# Altium schematic sheet Peripheral.SchDoc
size 420 x 297 mm; CheckedBy: Bao Bui Q.; Engineer: Hung Nguyen D.; Revision: 1.0.0; SheetNumber: 5; SheetTotal: 6
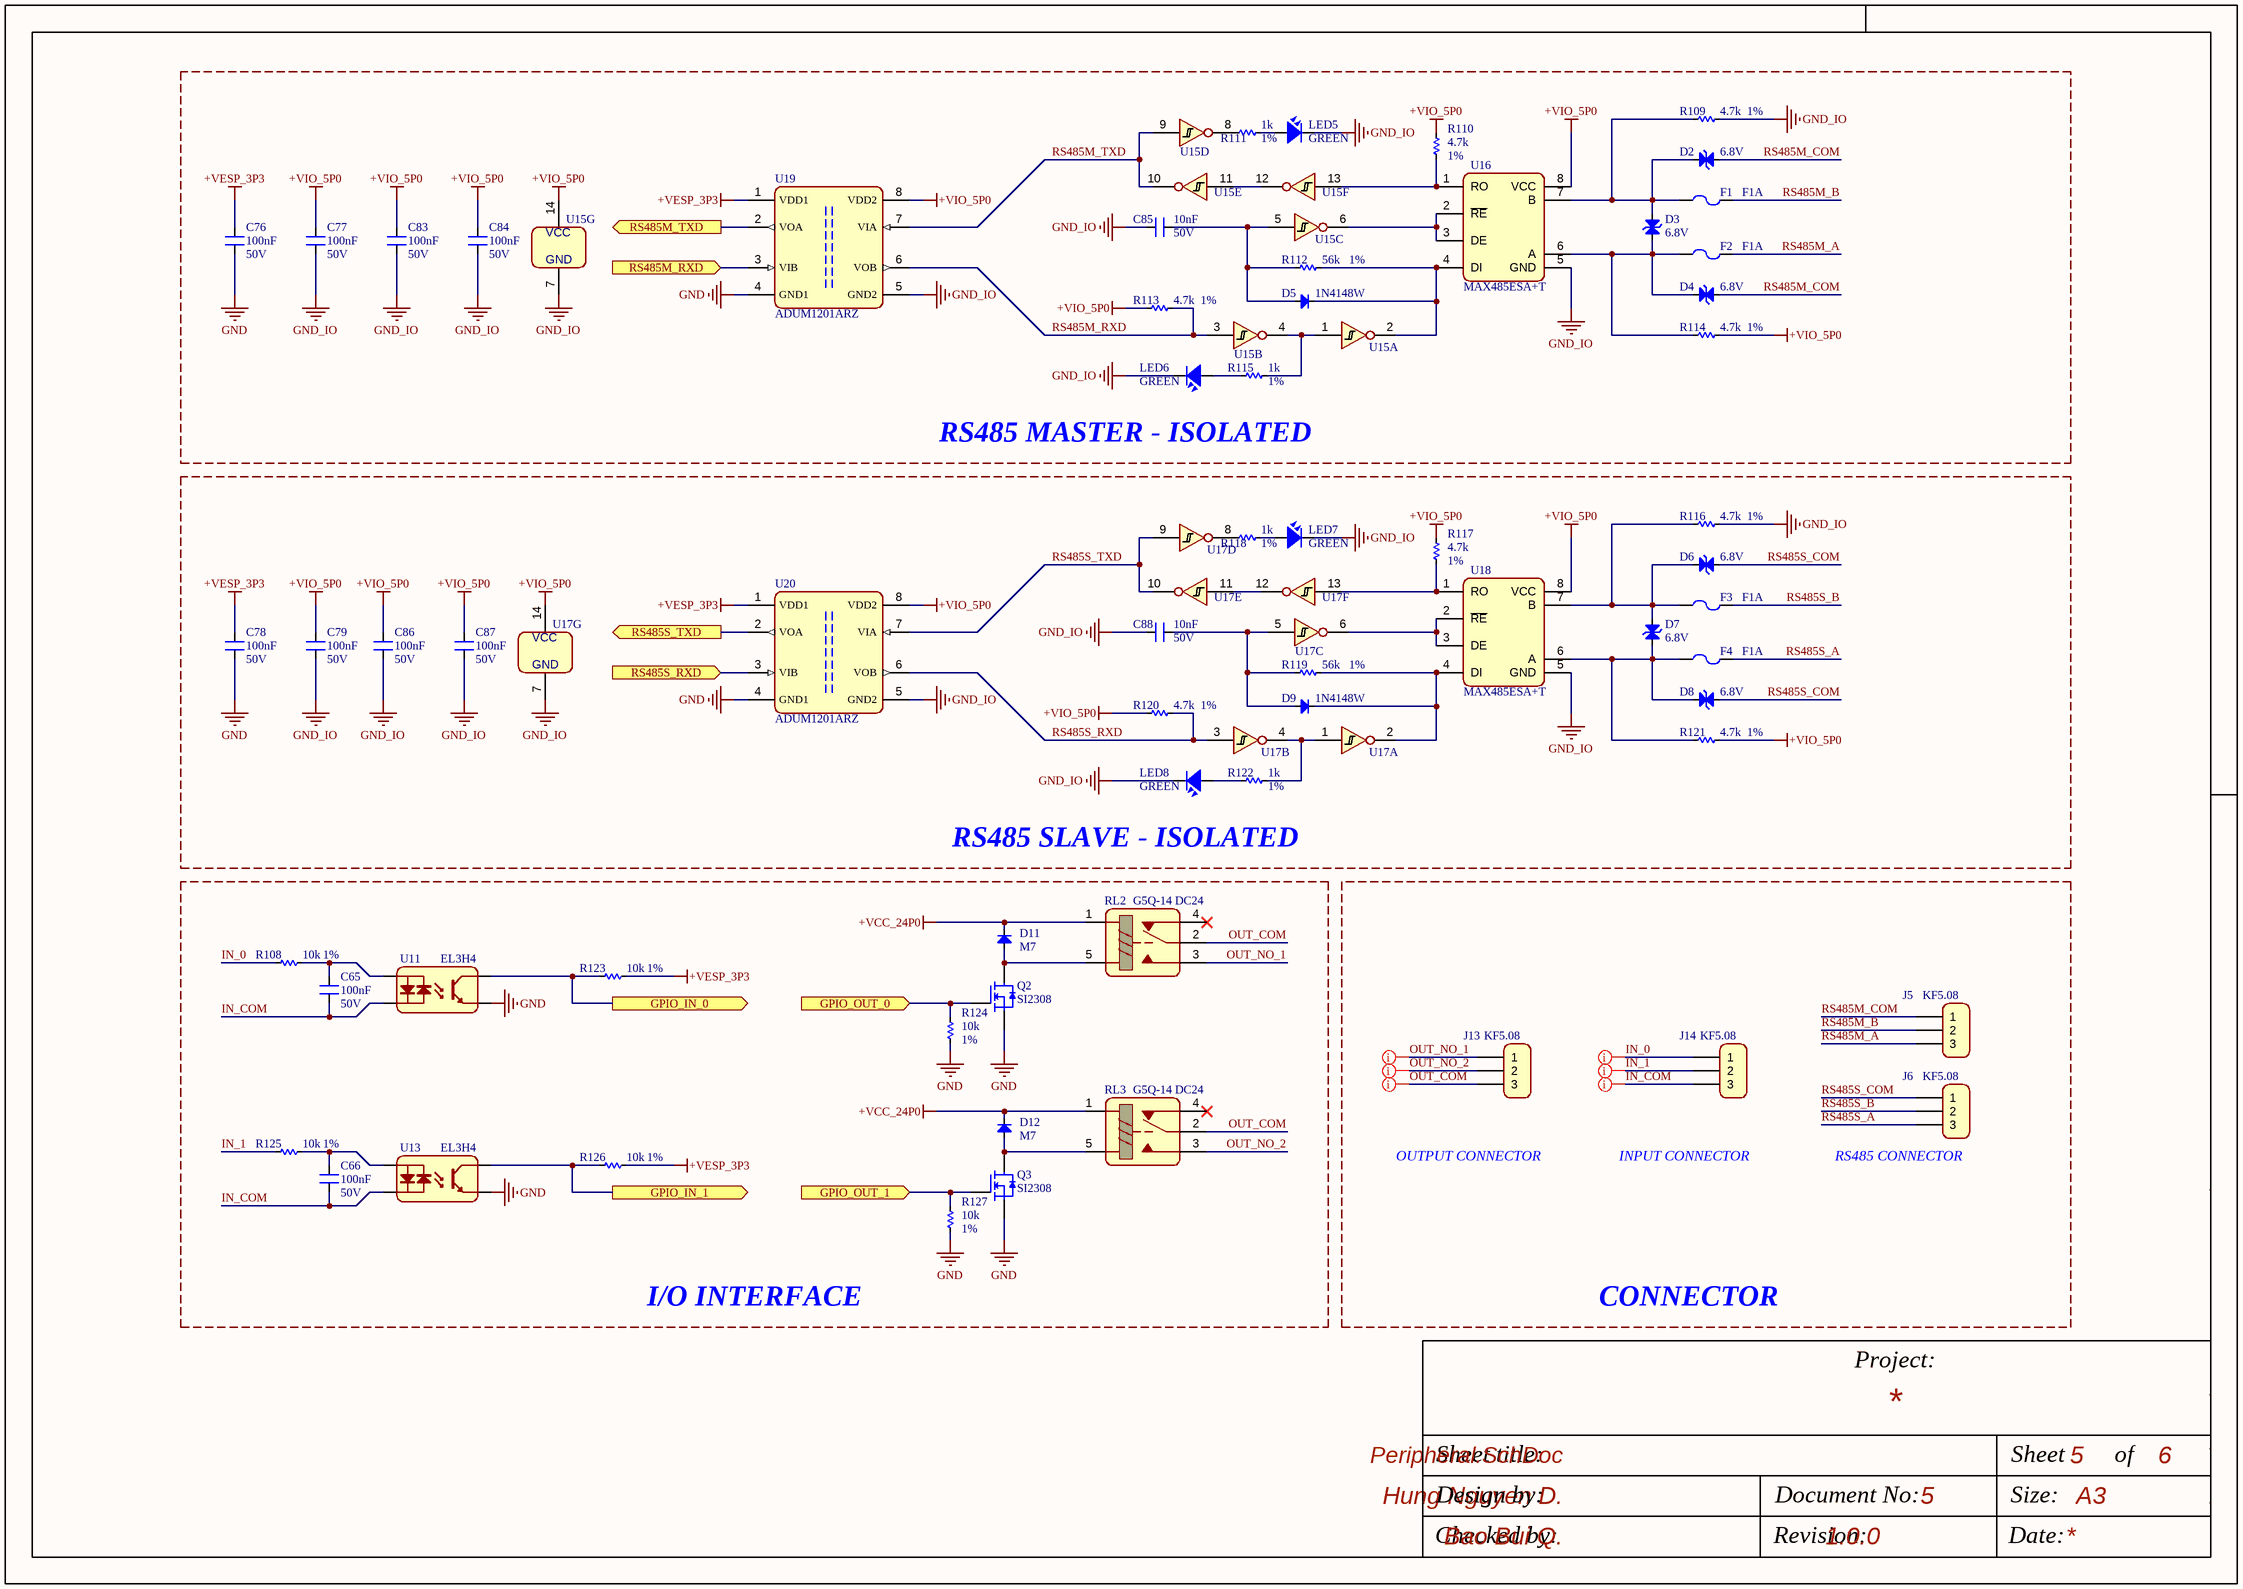
[diagram p0: Peripheral.SchDoc]

## Parts
C65  Rating: 50V  [CAP_SMD_0603]  (hidden comment: 100nF)
C66  Rating: 50V  [CAP_SMD_0603]  (hidden comment: 100nF)
C76  Rating: 50V  [CAP_SMD_0603]  (hidden comment: 100nF)
C77  Rating: 50V  [CAP_SMD_0603]  (hidden comment: 100nF)
C78  Rating: 50V  [CAP_SMD_0603]  (hidden comment: 100nF)
C79  Rating: 50V  [CAP_SMD_0603]  (hidden comment: 100nF)
C83  Rating: 50V  [CAP_SMD_0603]  (hidden comment: 100nF)
C84  Rating: 50V  [CAP_SMD_0603]  (hidden comment: 100nF)
C85  Rating: 50V  [CAP_SMD_0603]  (hidden comment: 10nF)
C86  Rating: 50V  [CAP_SMD_0603]  (hidden comment: 100nF)
C87  Rating: 50V  [CAP_SMD_0603]  (hidden comment: 100nF)
C88  Rating: 50V  [CAP_SMD_0603]  (hidden comment: 10nF)
D2  6.8V  [SOD123FL]
D3  6.8V  [SOD123FL]
D4  6.8V  [SOD123FL]
D5  1N4148W  [SOD323]
D6  6.8V  [SOD123FL]
D7  6.8V  [SOD123FL]
D8  6.8V  [SOD123FL]
D9  1N4148W  [SOD323]
D11  M7  [DIO-SMD-A]
D12  M7  [DIO-SMD-A]
F1  F1A  [FUSE_1812]
F2  F1A  [FUSE_1812]
F3  F1A  [FUSE_1812]
F4  F1A  [FUSE_1812]
J5  KF5.08  [KF3-5.08X]
J6  KF5.08  [KF3-5.08X]
J13  KF5.08  [KF3-5.08X]
J14  KF5.08  [KF3-5.08X]
LED5  GREEN  [GREENLED_0603]
LED6  GREEN  [GREENLED_0603]
LED7  GREEN  [GREENLED_0603]
LED8  GREEN  [GREENLED_0603]
Q2  SI2308  [SOT23-123]
Q3  SI2308  [SOT23-123]
R108  Tolerance: 1%  [RES_SMD_0603]  (hidden comment: 10k)
R109  Tolerance: 1%  [RES_SMD_0603]  (hidden comment: 4.7k)
R110  Tolerance: 1%  [RES_SMD_0603]  (hidden comment: 4.7k)
R111  Tolerance: 1%  [RES_SMD_0603]  (hidden comment: 1k)
R112  Tolerance: 1%  [RES_SMD_0603]  (hidden comment: 56k)
R113  Tolerance: 1%  [RES_SMD_0603]  (hidden comment: 4.7k)
R114  Tolerance: 1%  [RES_SMD_0603]  (hidden comment: 4.7k)
R115  Tolerance: 1%  [RES_SMD_0603]  (hidden comment: 1k)
R116  Tolerance: 1%  [RES_SMD_0603]  (hidden comment: 4.7k)
R117  Tolerance: 1%  [RES_SMD_0603]  (hidden comment: 4.7k)
R118  Tolerance: 1%  [RES_SMD_0603]  (hidden comment: 1k)
R119  Tolerance: 1%  [RES_SMD_0603]  (hidden comment: 56k)
R120  Tolerance: 1%  [RES_SMD_0603]  (hidden comment: 4.7k)
R121  Tolerance: 1%  [RES_SMD_0603]  (hidden comment: 4.7k)
R122  Tolerance: 1%  [RES_SMD_0603]  (hidden comment: 1k)
R123  Tolerance: 1%  [RES_SMD_0603]  (hidden comment: 10k)
R124  Tolerance: 1%  [RES_SMD_0603]  (hidden comment: 10k)
R125  Tolerance: 1%  [RES_SMD_0603]  (hidden comment: 10k)
R126  Tolerance: 1%  [RES_SMD_0603]  (hidden comment: 10k)
R127  Tolerance: 1%  [RES_SMD_0603]  (hidden comment: 10k)
RL2  G5Q-14 DC24  [RELAY-G5Q-14]
RL3  G5Q-14 DC24  [RELAY-G5Q-14]
U11  EL3H4  [SOIC-4-175mil]
U13  EL3H4  [SOIC-4-175mil]
U15  SN74HC14DR  [SOIC-14]  (value not drawn)  (parts A,B,C,D,E,F,G of 7)
U16  MAX485ESA+T  [SOIC-8]
U17  SN74HC14DR  [SOIC-14]  (value not drawn)  (parts A,B,C,D,E,F,G of 7)
U18  MAX485ESA+T  [SOIC-8]
U19  ADUM1201ARZ  [SOIC-8]
U20  ADUM1201ARZ  [SOIC-8]

## Blocks framed on the sheet
RS485 MASTER - ISOLATED: C76 C77 C83-C85 D2-D5 F1 F2 LED5 LED6 R109-R115 U15 U16 U19
RS485 SLAVE - ISOLATED: C78 C79 C86-C88 D6-D9 F3 F4 LED7 LED8 R116-R122 U17 U18 U20
I/O INTERFACE: C65 C66 D11 D12 Q2 Q3 R108 R123-R127 RL2 RL3 U11 U13
CONNECTOR: J5 J6 J13 J14

## Ports
GPIO_IN_0 (out, see Architecture[5B]), GPIO_IN_1 (out, see Architecture[5B]), GPIO_OUT_0 (in, see Architecture[5B]), GPIO_OUT_1 (in, see Architecture[5B]), RS485M_RXD (in, see Architecture[5B]), RS485M_TXD (out, see Architecture[5B]), RS485S_RXD (in, see Architecture[5B]), RS485S_TXD (out, see Architecture[5B])

## Nets
+VCC_24P0: D11.2(K) D12.2(K) RL2.1(COIL) RL3.1(COIL)
+VESP_3P3: C76.1 C78.1 R123.2 R126.2 U19.1(VDD1) U20.1(VDD1)
+VIO_5P0: C77.1 C79.1 C83.1 C84.1 C86.1 C87.1 R110.1 R113.2 R114.1 R117.1 R120.2 R121.1 U15.14(VCC) U16.8(VCC) U17.14(VCC) U18.8(VCC) U19.8(VDD2) U20.8(VDD2)
GND: C76.2 C78.2 Q2.2 Q3.2 R124.2 R127.2 U11.3(E) U13.3(E) U19.4(GND1) U20.4(GND1)
GND_IO: C77.2 C79.2 C83.2 C84.2 C85.2 C86.2 C87.2 C88.2 LED5.2 LED6.2 LED7.2 LED8.2 R109.1 R116.1 U15.7(GND) U16.5(GND) U17.7(GND) U18.5(GND) U19.5(GND2) U20.5(GND2)
GPIO_IN_0: R123.1 U11.4(C) ; port GPIO_IN_0
GPIO_IN_1: R126.1 U13.4(C) ; port GPIO_IN_1
GPIO_OUT_0: Q2.1 R124.1 ; port GPIO_OUT_0
GPIO_OUT_1: Q3.1 R127.1 ; port GPIO_OUT_1
IN_0: J14.1 R108.1
IN_1: J14.2 R125.1
IN_COM: C65.2 C66.2 J14.3 U11.2(AC) U13.2(AC)
OUT_COM: J13.3 RL2.2(COM) RL3.2(COM)
OUT_NO_1: J13.1 RL2.3
OUT_NO_2: J13.2 RL3.3
RS485M_A: F2.2 J5.3
RS485M_B: F1.2 J5.2
RS485M_COM: D2.2 D4.2 J5.1
RS485M_RXD: R113.1 U15.3(A) U19.6(VOB)
RS485M_RXD: U19.3(VIB) ; port RS485M_RXD  [a separate net that carries the same name]
RS485M_TXD: U15.9(A) U15.10(Y) U19.7(VIA)
RS485M_TXD: U19.2(VOA) ; port RS485M_TXD  [a separate net that carries the same name]
RS485S_A: F4.2 J6.3
RS485S_B: F3.2 J6.2
RS485S_COM: D6.2 D8.2 J6.1
RS485S_RXD: R120.1 U17.3(A) U20.6(VOB)
RS485S_RXD: U20.3(VIB) ; port RS485S_RXD  [a separate net that carries the same name]
RS485S_TXD: U17.9(A) U17.10(Y) U20.7(VIA)
RS485S_TXD: U20.2(VOA) ; port RS485S_TXD  [a separate net that carries the same name]
NetC65_1: C65.1 R108.2 U11.1(AC)
NetC66_1: C66.1 R125.2 U13.1(AC)
NetC85_1: C85.1 D5.1(A) R112.2 U15.5(A)
NetC88_1: C88.1 D9.1(A) R119.2 U17.5(A)
NetD2_1: D2.1 D3.1 F1.1 R109.2 U16.7(B)
NetD3_2: D3.2 D4.1 F2.1 R114.2 U16.6(A)
NetD5_2: D5.2(K) R112.1 U15.2(Y) U16.4(DI)
NetD6_1: D6.1 D7.1 F3.1 R116.2 U18.7(B)
NetD7_2: D7.2 D8.1 F4.1 R121.2 U18.6(A)
NetD9_2: D9.2(K) R119.1 U17.2(Y) U18.4(DI)
NetD11_1: D11.1(A) Q2.3 RL2.5(COIL)
NetD12_1: D12.1(A) Q3.3 RL3.5(COIL)
NetLED5_1: LED5.1 R111.2
NetLED6_1: LED6.1 R115.1
NetLED7_1: LED7.1 R118.2
NetLED8_1: LED8.1 R122.1
NetR110_2: R110.2 U15.13(A) U16.1(RO)
NetR111_1: R111.1 U15.8(Y)
NetR115_2: R115.2 U15.1(A) U15.4(Y)
NetR117_2: R117.2 U17.13(A) U18.1(RO)
NetR118_1: R118.1 U17.8(Y)
NetR122_2: R122.2 U17.1(A) U17.4(Y)
NetU15_6: U15.6(Y) U16.2(~{RE}) U16.3(DE)
NetU15_11: U15.11(A) U15.12(Y)
NetU17_6: U17.6(Y) U18.2(~{RE}) U18.3(DE)
NetU17_11: U17.11(A) U17.12(Y)

Not connected (* = marked no-connect by the designer): RL2 4(NC)*; RL3 4(NC)*

## Layout directives
net class HV_SIG: IN_0, IN_1, IN_COM, OUT_COM, OUT_NO_1, OUT_NO_2

## Notes on the sheet
- OUTPUT CONNECTOR
- INPUT CONNECTOR
- (near J6) RS485 CONNECTOR
- Project:
- Sheet title:
- Sheet
- of
- Design by:
- Document No:
- Size:
- A3
- Checked by:
- Revision:
- Date:

## Library data of the parts
C65 C66 C76-C79 C83-C88 = CN: PN: *; LCSC: *
  C65 C66 C76-C79 C83 C84 C86 C87: Value: 100nF
  C85 C88: Value: 10nF
D2-D4 D6-D8 = TVS DIODE: PN: *; LCSC: *; Value: 6.8V
D5 D9 D11 D12 = Diode SMD: Default Diode; LCSC: *; PN: *
  D5 D9: Value: 1N4148W
  D11 D12: Value: M7
F1-F4 = Fuse: Designed by: VanDungEvn; Value: Fuse
J5 J6 J13 J14 = KF3: ComponentLink1 Description: Manufacturer; ComponentLink2 Description: Datasheet; ComponentLink1URL: http://www.we-online.com; ComponentLink2URL: http://katalog.we-online.de/em/datasheet/6911031100xx.pdf; PN: *; LCSC: *; Value: KF5.08
LED5-LED8 = LED SMD: PN: *; LCSC: *; Value: GREEN
Q2 Q3 = FET-N: PN: *; LCSC: *; Value: SI2308
R108-R127 = Res-SMD: Resistor; PN: *; LCSC: *
  R108 R123-R127: Value: 10k
  R109 R110 R113 R114 R116 R117 R120 R121: Value: 4.7k
  R111 R115 R118 R122: Value: 1k
  R112 R119: Value: 56k
RL2 RL3 = Relay 5: Relay SPDT,10A - 12VDC 5 Pin; PN: G5Q-14 DC24; LCSC: C397242; Value: G5Q-14 DC24
U11 U13 = OPTO_AC: AC,DC Integrated anti-parallel LED Phototransistor; PN: EL3H4(A)(TA)-VG; LCSC: C42384997; Value: EL3H4
U15 U17 = 74HC14: -40℃~+85℃ 1 1.5V~4.2V 21ns@6V,50pF 2V~6V 2uA 300mV~1.2V 5.2mA 5.2mA 6 74HC Series Schmitt trigger SOIC-14 Inverters ROHS; Value: SN74HC14DR; PN: SN74HC14DR; LCSC: C6820
U16 U18 = MAX485: -40℃~+85℃ 1 1 2.5Mbps 4.75V~5.25V Transceiver SOIC-8 RS-485 / RS-422 ICs ROHS; PN: MAX485ESA+T; LCSC: C19738; Value: MAX485ESA+T
U19 U20 = ADUM1201: -40℃~+105℃ 1 1 1Mbps 2.7V~5.5V 2.7V~5.5V 2500 25kV/us 50ns Bidirectional signal isolation、Multi-voltage domain interface、Power-on reset SOIC-8 Digital Isolators ROHS; PN: ADUM1201ARZ; LCSC: C9669; Value: ADUM1201ARZ